# Altium project Hardware.PrjPcb
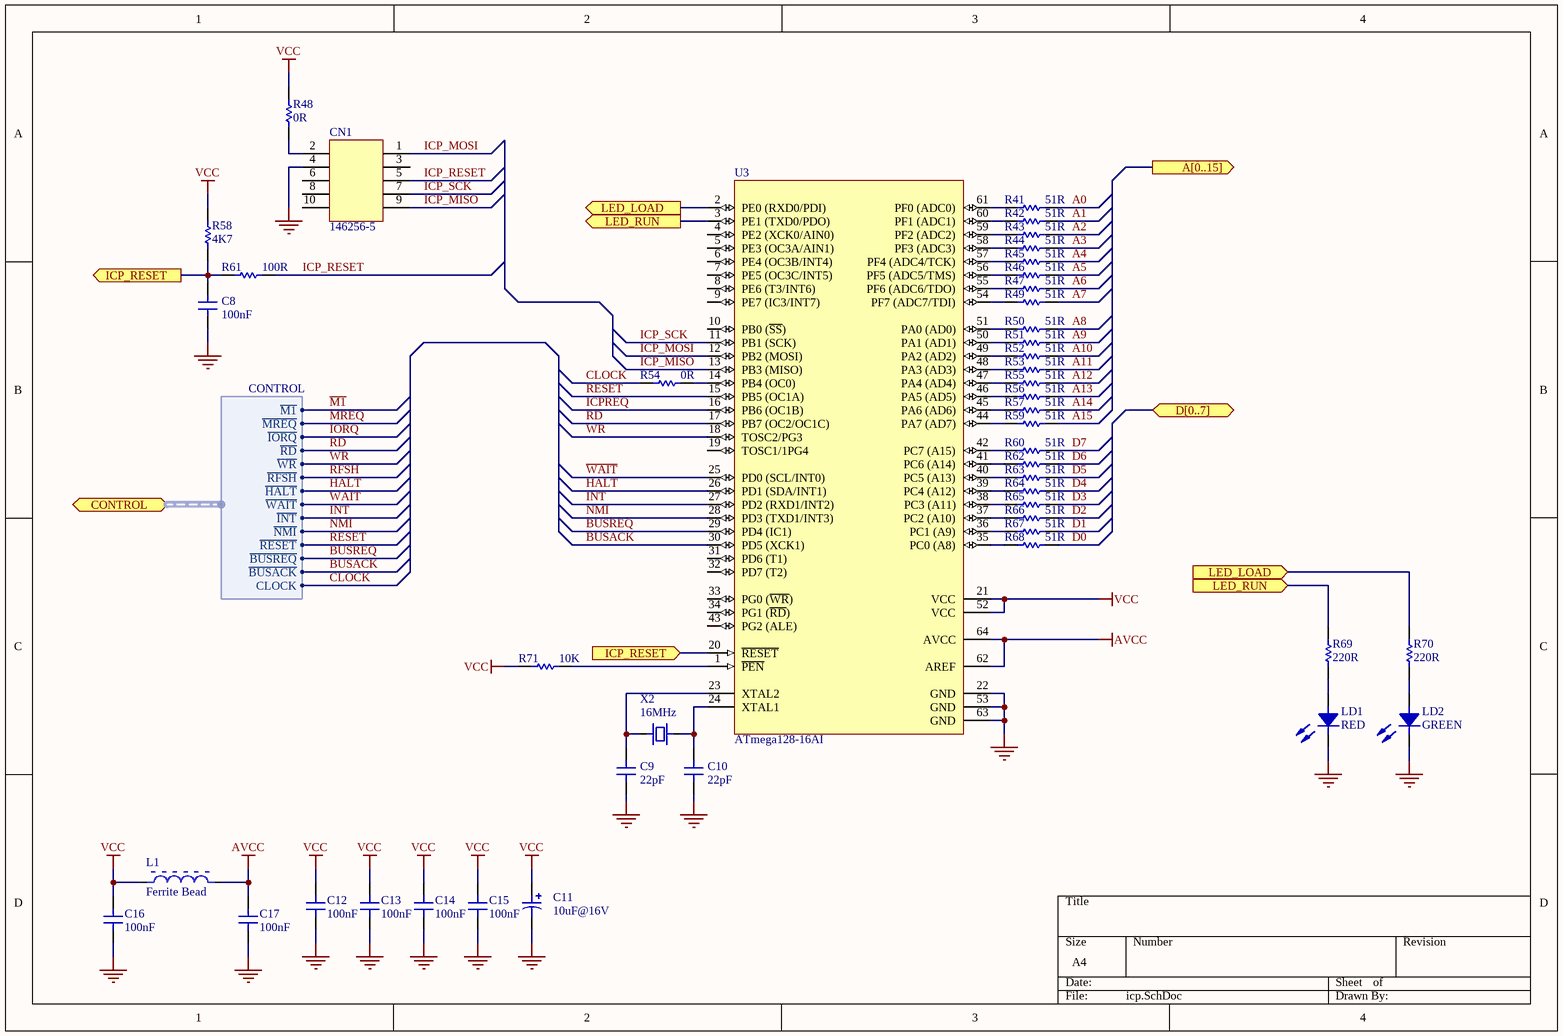
[diagram p0: icp.SchDoc]
6 sheets, 81 parts. Net scope: hierarchical (ports join the sheet entries above them; power ports are global).
Board file: Zillion.PcbDoc
Sheets:
  parallel.SchDoc
  icp.SchDoc
  Zillion.SchDoc
    CPU = cpu.SchDoc
    Memory = memory.SchDoc
    UART = uart.SchDoc

## Sheet parallel.SchDoc
size A4

## Sheet icp.SchDoc
size A4

### Parts
(Parts that share a designator on the sheet are numbered #1, #2 ... from top to bottom, then left to right.)
C8#1  100nF  [0805]
C9#1  22pF  [0805]
C10#1  22pF  [0805]
C11#1  10uF@16V  [1206 Polarized]
C12  100nF  [0805]
C13  100nF  [0805]
C14  100nF  [0805]
C15  100nF  [0805]
C16  100nF  [0805]
C17  100nF  [0805]
CN1#1  146256-5  [146256-5]
L1  Ferrite Bead  [0805]
LD1  RED  [0805 Semiconductor]
LD2  GREEN  [0805 Semiconductor]
R41  51R  [0805]
R42  51R  [0805]
R43  51R  [0805]
R44  51R  [0805]
R45  51R  [0805]
R46  51R  [0805]
R47  51R  [0805]
R48  0R  [0402]
R49  51R  [0805]
R50  51R  [0805]
R51  51R  [0805]
R52  51R  [0805]
R53  51R  [0805]
R54  0R  [0402]
R55  51R  [0805]
R56  51R  [0805]
R57  51R  [0805]
R58  4K7  [0805]
R59  51R  [0805]
R60  51R  [0805]
R61  100R  [0805]
R62  51R  [0805]
R63  51R  [0805]
R64  51R  [0805]
R65  51R  [0805]
R66  51R  [0805]
R67  51R  [0805]
R68  51R  [0805]
R69  220R  [0805]
R70  220R  [0805]
R71  10K  [0402]
U3#1  ATmega128-16AI  [64A_N]
X2  16MHz  [HC49S]

### Ports
A[0..15] (out), CONTROL (harness CONTROL), D[0..7] (bidir), ICP_RESET (in), ICP_RESET (out), LED_LOAD (in), LED_LOAD (out), LED_RUN (in), LED_RUN (out)

### Harnesses
CONTROL: ~{M1}, ~{MREQ}, ~{IORQ}, ~{RD}, ~{WR}, ~{RFSH}, ~{HALT}, ~{WAIT}, ~{INT}, ~{NMI}, ~{RESET}, ~{BUSREQ}, ~{BUSACK}, CLOCK

### Nets
AVCC: C17.1 L1.2 U3#1.62(AREF) U3#1.64(AVCC)
GND: C8#1.1 C9#1.1 C10#1.1 C11#1.2 C12.2 C13.2 C14.2 C15.2 C16.2 C17.2 CN1#1.4 LD1.1 LD2.1 U3#1.22(GND) U3#1.53(GND) U3#1.63(GND)
VCC: C11#1.1 C12.1 C13.1 C14.1 C15.1 C16.1 L1.1 R48.2 R58.2 R71.2 U3#1.21(VCC) U3#1.52(VCC)
A0: R41.2
A1: R42.2
A2: R43.2
A3: R44.2
A4: R45.2
A5: R46.2
A6: R47.2
A7: R49.2
A8: R50.2
A9: R51.2
A10: R52.2
A11: R53.2
A12: R55.2
A13: R56.2
A14: R57.2
A15: R59.2
~{BUSACK}: U3#1.30(PD5_(XCK1)) ; port CONTROL.~{BUSACK}
~{BUSREQ}: U3#1.29(PD4_(IC1)) ; port CONTROL.~{BUSREQ}
CLOCK: R54.2 ; port CONTROL.CLOCK
D0: R68.2
D1: R67.2
D2: R66.2
D3: R65.2
D4: R64.2
D5: R63.2
D6: R62.2
D7: R60.2
~{HALT}: U3#1.26(PD1_(SDA/INT1)) ; port CONTROL.~{HALT}
~{ICPREQ}: U3#1.16(PB6_(OC1B))
~{INT}: U3#1.27(PD2_(RXD1/INT2)) ; port CONTROL.~{INT}
~{IORQ}: port CONTROL.~{IORQ}
ICP_MISO: CN1#1.9 U3#1.13(PB3_(MISO))
ICP_MOSI: CN1#1.1 U3#1.12(PB2_(MOSI))
ICP_RESET: CN1#1.5 R61.1
ICP_SCK: CN1#1.7 U3#1.11(PB1_(SCK))
~{M1}: port CONTROL.~{M1}
~{MREQ}: port CONTROL.~{MREQ}
~{NMI}: U3#1.28(PD3_(TXD1/INT3)) ; port CONTROL.~{NMI}
~{RD}: U3#1.17(PB7_(OC2/OC1C)) ; port CONTROL.~{RD}
~{RESET}: U3#1.15(PB5_(OC1A)) ; port CONTROL.~{RESET}
~{RFSH}: port CONTROL.~{RFSH}
~{WAIT}: U3#1.25(PD0_(SCL/INT0)) ; port CONTROL.~{WAIT}
~{WR}: U3#1.18(TOSC2/PG3) ; port CONTROL.~{WR}
NetC8#1_2: C8#1.2 R58.1 R61.2 U3#1.20(~{RESET}) ; port ICP_RESET
NetC9#1_2: C9#1.2 U3#1.23(XTAL2) X2.1
NetC10#1_2: C10#1.2 U3#1.24(XTAL1) X2.2
NetCN1#1_2: CN1#1.2 R48.1
NetLD1_2: LD1.2 R69.1
NetLD2_2: LD2.2 R70.1
NetR41_1: R41.1 U3#1.61(PF0_(ADC0))
NetR42_1: R42.1 U3#1.60(PF1_(ADC1))
NetR43_1: R43.1 U3#1.59(PF2_(ADC2))
NetR44_1: R44.1 U3#1.58(PF3_(ADC3))
NetR45_1: R45.1 U3#1.57(PF4_(ADC4/TCK))
NetR46_1: R46.1 U3#1.56(PF5_(ADC5/TMS))
NetR47_1: R47.1 U3#1.55(PF6_(ADC6/TDO))
NetR49_1: R49.1 U3#1.54(PF7_(ADC7/TDI))
NetR50_1: R50.1 U3#1.51(PA0_(AD0))
NetR51_1: R51.1 U3#1.50(PA1_(AD1))
NetR52_1: R52.1 U3#1.49(PA2_(AD2))
NetR53_1: R53.1 U3#1.48(PA3_(AD3))
NetR54_1: R54.1 U3#1.14(PB4_(OC0))
NetR55_1: R55.1 U3#1.47(PA4_(AD4))
NetR56_1: R56.1 U3#1.46(PA5_(AD5))
NetR57_1: R57.1 U3#1.45(PA6_(AD6))
NetR59_1: R59.1 U3#1.44(PA7_(AD7))
NetR60_1: R60.1 U3#1.42(PC7_(A15))
NetR62_1: R62.1 U3#1.41(PC6_(A14))
NetR63_1: R63.1 U3#1.40(PC5_(A13))
NetR64_1: R64.1 U3#1.39(PC4_(A12))
NetR65_1: R65.1 U3#1.38(PC3_(A11))
NetR66_1: R66.1 U3#1.37(PC2_(A10))
NetR67_1: R67.1 U3#1.36(PC1_(A9))
NetR68_1: R68.1 U3#1.35(PC0_(A8))
NetR69_2: R69.2 U3#1.3(PE1_(TXD0/PDO)) ; port LED_RUN
NetR70_2: R70.2 U3#1.2(PE0_(RXD0/PDI)) ; port LED_LOAD
NetR71_1: R71.1 U3#1.1(~{PEN})

Not connected (* = marked no-connect by the designer): CN1#1 3 6 8 10; U3#1 4(PE2_(XCK0/AIN0)) 5(PE3_(OC3A/AIN1)) 6(PE4_(OC3B/INT4)) 7(PE5_(OC3C/INT5)) 8(PE6_(T3/INT6)) 9(PE7_(IC3/INT7)) 10(PB0_(~{SS})) 19(TOSC1/1PG4) 31(PD6_(T1)) 32(PD7_(T2)) 33(PG0_(~{WR})) 34(PG1_(~{RD})) 43(PG2_(ALE))

### Library data of the parts
C8#1 C9#1 C10#1 C12-C17 = Capacitor
C11#1 = Capacitor Polarized
CN1#1 = 146256-5: CONN Header Breakaway
LD1 LD2 = LED
R41-R71 = Resistor
U3#1 = ATmega128-16AI: 8-Bit AVR Microcontroller with 128K Bytes of In-System Programmable Flash Memory; Published: 17-Sep-2003; LatestRevisionDate: 16-Oct-2006; LatestRevisionNote: IPC-7351 Footprint Added.; DatasheetVersion: 2467G-AVR-09/02; PackageVersion: revB, Oct-2001; PackageReference: 64A; Publisher: Altium Limited; PackageDescription: 64-Pin Plastic Thin Profile Quad Flat Pack, 14 x 14 x 1.0 mm Body, 0.8 mm Pitch (TQFP); Supplier 1: Digi-Key; Supplier Part Number 1: ATMEGA128-16AI-ND; Supplier 2: Mouser; Supplier Part Number 2: 556-ATMEGA12816AI; Code_JEDEC: MS-026-AEB; ComponentLink1Description: Datasheet; ComponentLink1URL: http://www.atmel.com/dyn/resources/prod_documents/doc2467.pdf; ComponentLink2Description: Atmel.com Home; ComponentLink2URL: http://www.atmel.com
X2 = HC49S: Crystal HC49S

## Sheet Zillion.SchDoc: Zillion - Z80 Single Board Computer
size A4; Author: Francesco Sacco; Revision: 0; ProjectName: Zillion - Z80 Single Board Computer
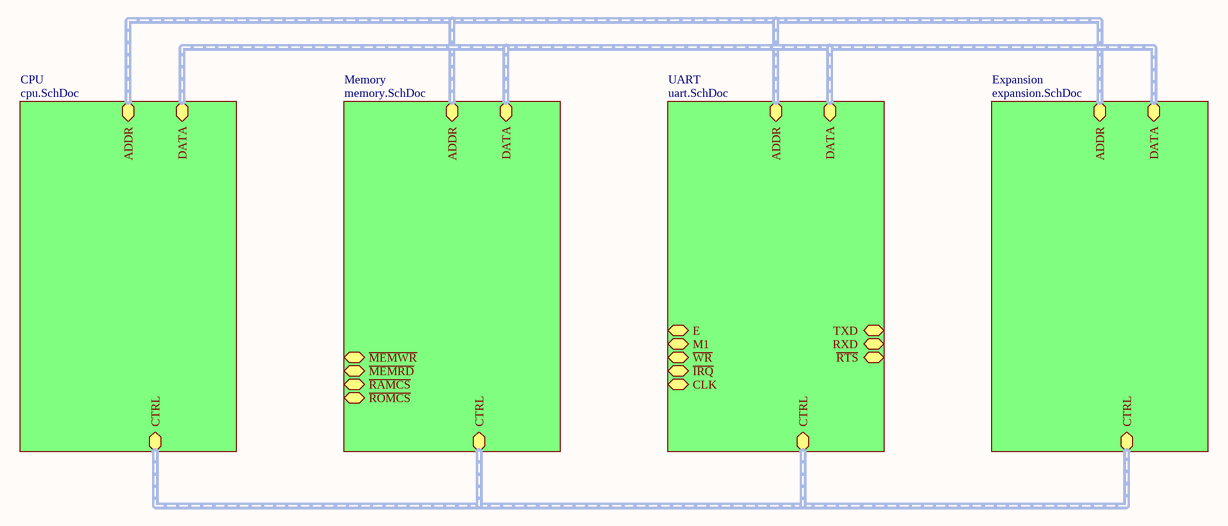
[diagram p1: Zillion.SchDoc]

### Sub-sheets
CPU = cpu.SchDoc: ADDR (harness ADDR), DATA (harness DATA), CTRL (harness CTRL)
Expansion = expansion.SchDoc (file not in this document): ADDR (harness ADDR), DATA (harness DATA), CTRL (harness CTRL)
Memory = memory.SchDoc: ADDR (harness ADDR), DATA (harness DATA), CTRL (harness CTRL), ~{MEMWR}, ~{MEMRD}, ~{RAMCS}, ~{ROMCS}
UART = uart.SchDoc: ADDR (harness ADDR), DATA (harness DATA), CTRL (harness CTRL), E, M1, ~{WR}, ~{IRQ}, CLK, ~{RTS}, TXD, RXD

### Buses and harness runs
harness sheet CPU/ADDR = sheet Expansion/ADDR = sheet Memory/ADDR = sheet UART/ADDR
harness sheet CPU/CTRL = sheet Expansion/CTRL = sheet Memory/CTRL = sheet UART/CTRL
harness sheet CPU/DATA = sheet Expansion/DATA = sheet Memory/DATA = sheet UART/DATA

## Sheet cpu.SchDoc: Zillion - Z80 Single Board Computer
size A4; Author: Francesco Sacco; Revision: 0; ProjectName: Zillion - Z80 Single Board Computer
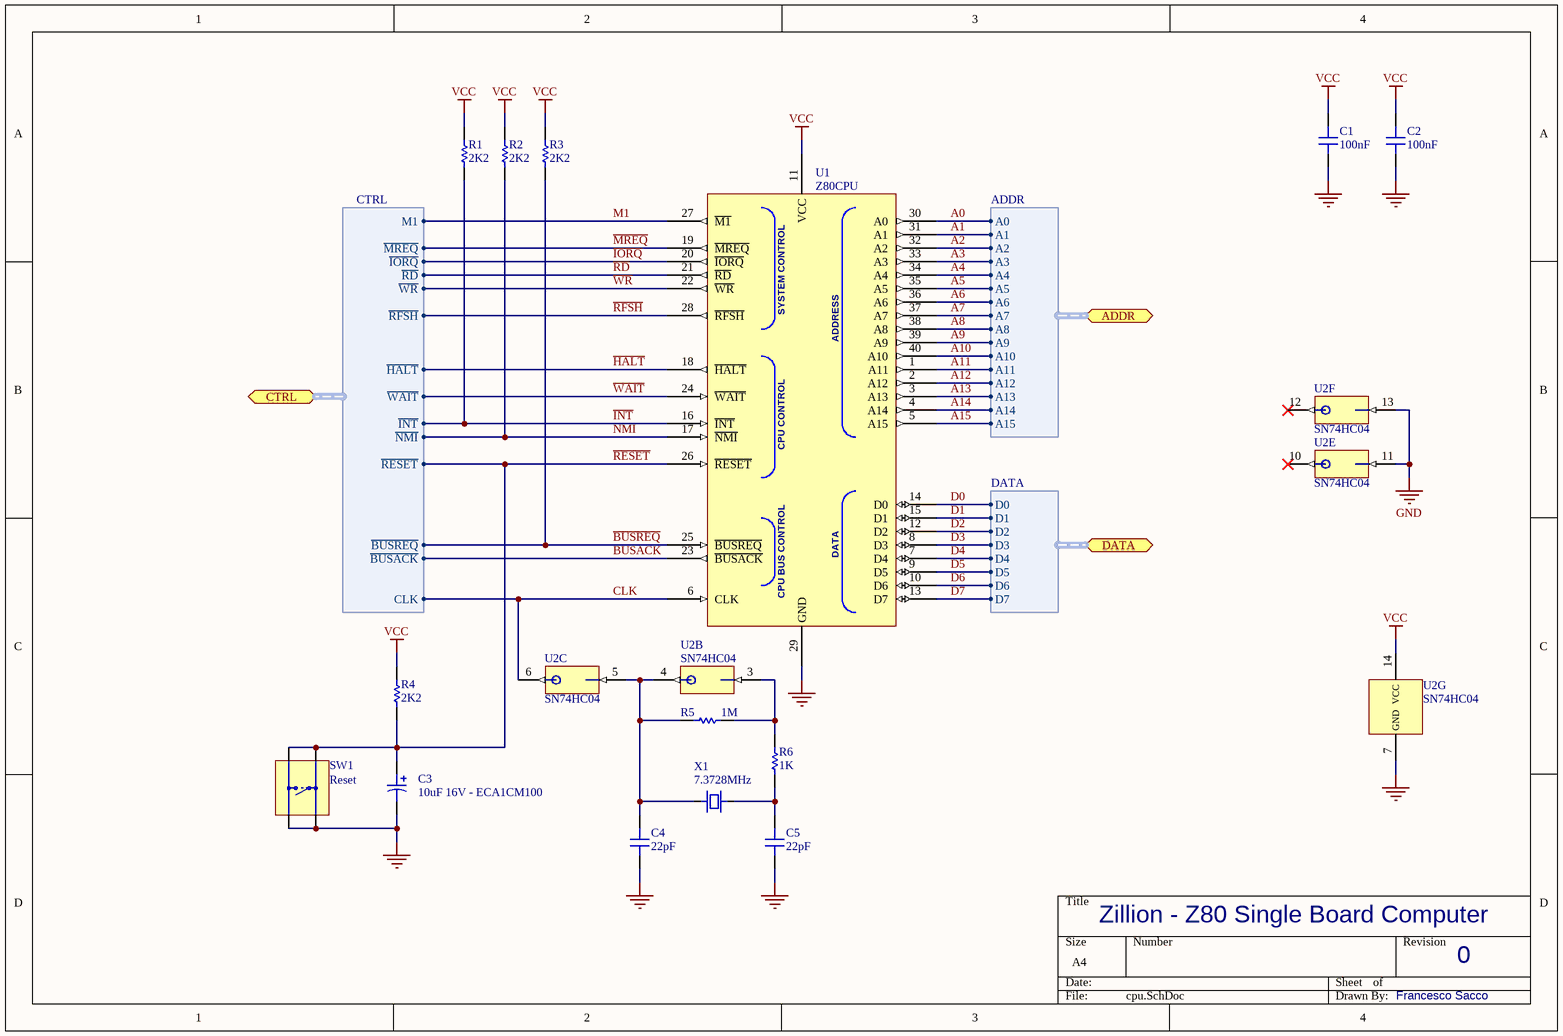
[diagram p2: cpu.SchDoc]

### Parts
C1  100nF  [DiskCapacitor]
C2  100nF  [DiskCapacitor]
C3  10uF 16V - ECA1CM100  [ECA 5x11]
C4  22pF  [DiskCapacitor]
C5  22pF  [DiskCapacitor]
R1  2K2  [CR12]
R2  2K2  [CR12]
R3  2K2  [CR12]
R4  2K2  [CR12]
R5  1M  [CR12]
R6  1K  [CR12]
SW1  Reset  [EVQPAx09K]
U1  Z80CPU  [Z84C00xxPEG]
U2  SN74HC04  [CDIP14]  (parts B,C,E,F,G of 7)
X1  7.3728MHz  [HC49S]

### Ports
ADDR (harness ADDR), CTRL (harness CTRL), DATA (harness DATA)

### Harnesses
ADDR: A0, A1, A2, A3, A4, A5, A6, A7, A8, A9, A10, A11, A12, A13, A14, A15
DATA: D0, D1, D2, D3, D4, D5, D6, D7
CTRL: M1, ~{MREQ}, ~{IORQ}, ~{RD}, ~{WR}, ~{RFSH}, ~{HALT}, ~{WAIT}, ~{INT}, ~{NMI}, ~{RESET}, ~{BUSREQ}, ~{BUSACK}, CLK

### Nets
GND: C1.1 C2.1 C3.2 C4.1 C5.1 SW1.1 SW1.2 U1.29(GND) U2.7(GND) U2.11(A) U2.13(A)
VCC: C1.2 C2.2 R1.2 R2.2 R3.2 R4.2 U1.11(VCC) U2.14(VCC)
A0: U1.30(A0) ; port ADDR.A0
A1: U1.31(A1) ; port ADDR.A1
A2: U1.32(A2) ; port ADDR.A2
A3: U1.33(A3) ; port ADDR.A3
A4: U1.34(A4) ; port ADDR.A4
A5: U1.35(A5) ; port ADDR.A5
A6: U1.36(A6) ; port ADDR.A6
A7: U1.37(A7) ; port ADDR.A7
A8: U1.38(A8) ; port ADDR.A8
A9: U1.39(A9) ; port ADDR.A9
A10: U1.40(A10) ; port ADDR.A10
A11: U1.1(A11) ; port ADDR.A11
A12: U1.2(A12) ; port ADDR.A12
A13: U1.3(A13) ; port ADDR.A13
A14: U1.4(A14) ; port ADDR.A14
A15: U1.5(A15) ; port ADDR.A15
~{BUSACK}: U1.23(~{BUSACK}) ; port CTRL.~{BUSACK}
~{BUSREQ}: R3.1 U1.25(~{BUSREQ}) ; port CTRL.~{BUSREQ}
CLK: U1.6(CLK) U2.6(Y) ; port CTRL.CLK
D0: U1.14(D0) ; port DATA.D0
D1: U1.15(D1) ; port DATA.D1
D2: U1.12(D2) ; port DATA.D2
D3: U1.8(D3) ; port DATA.D3
D4: U1.7(D4) ; port DATA.D4
D5: U1.9(D5) ; port DATA.D5
D6: U1.10(D6) ; port DATA.D6
D7: U1.13(D7) ; port DATA.D7
~{HALT}: U1.18(~{HALT}) ; port CTRL.~{HALT}
~{INT}: R1.1 U1.16(~{INT}) ; port CTRL.~{INT}
~{IORQ}: U1.20(~{IORQ}) ; port CTRL.~{IORQ}
M1: U1.27(~{M1}) ; port CTRL.M1
~{MREQ}: U1.19(~{MREQ}) ; port CTRL.~{MREQ}
~{NMI}: R2.1 U1.17(~{NMI}) ; port CTRL.~{NMI}
~{RD}: U1.21(~{RD}) ; port CTRL.~{RD}
~{RESET}: C3.1 R4.1 SW1.3 SW1.4 U1.26(~{RESET}) ; port CTRL.~{RESET}
~{RFSH}: U1.28(~{RFSH}) ; port CTRL.~{RFSH}
~{WAIT}: U1.24(~{WAIT}) ; port CTRL.~{WAIT}
~{WR}: U1.22(~{WR}) ; port CTRL.~{WR}
NetC4_2: C4.2 R5.2 U2.4(Y) U2.5(A) X1.1
NetC5_2: C5.2 R6.1 X1.2
NetR5_1: R5.1 R6.2 U2.3(A)

Not connected (* = marked no-connect by the designer): U2 10(Y)* 12(Y)*

### Notes on the sheet
- (in symbol Z84C00xxPEG) SYSTEM CONTROL; ADDRESS; CPU CONTROL; DATA; CPU BUS CONTROL

### Library data of the parts
C1 C2 C4 C5 = Capacitor
C3 = ECA1CM100: 10uF 16V
R1-R4 = Resistor
R5 R6 = Resistor: 2K2
SW1 = EVQPA: 5N Type Light Touch Switches
U1 = Z84C00xxPEG: Z80 - CPU
U2 = SN74HC04: Hex Inverters
X1 = HC49S: Crystal HC49S

## Sheet memory.SchDoc: Zillion - Z80 Single Board Computer
size A4; Author: Francesco Sacco; Revision: 0; ProjectName: Zillion - Z80 Single Board Computer
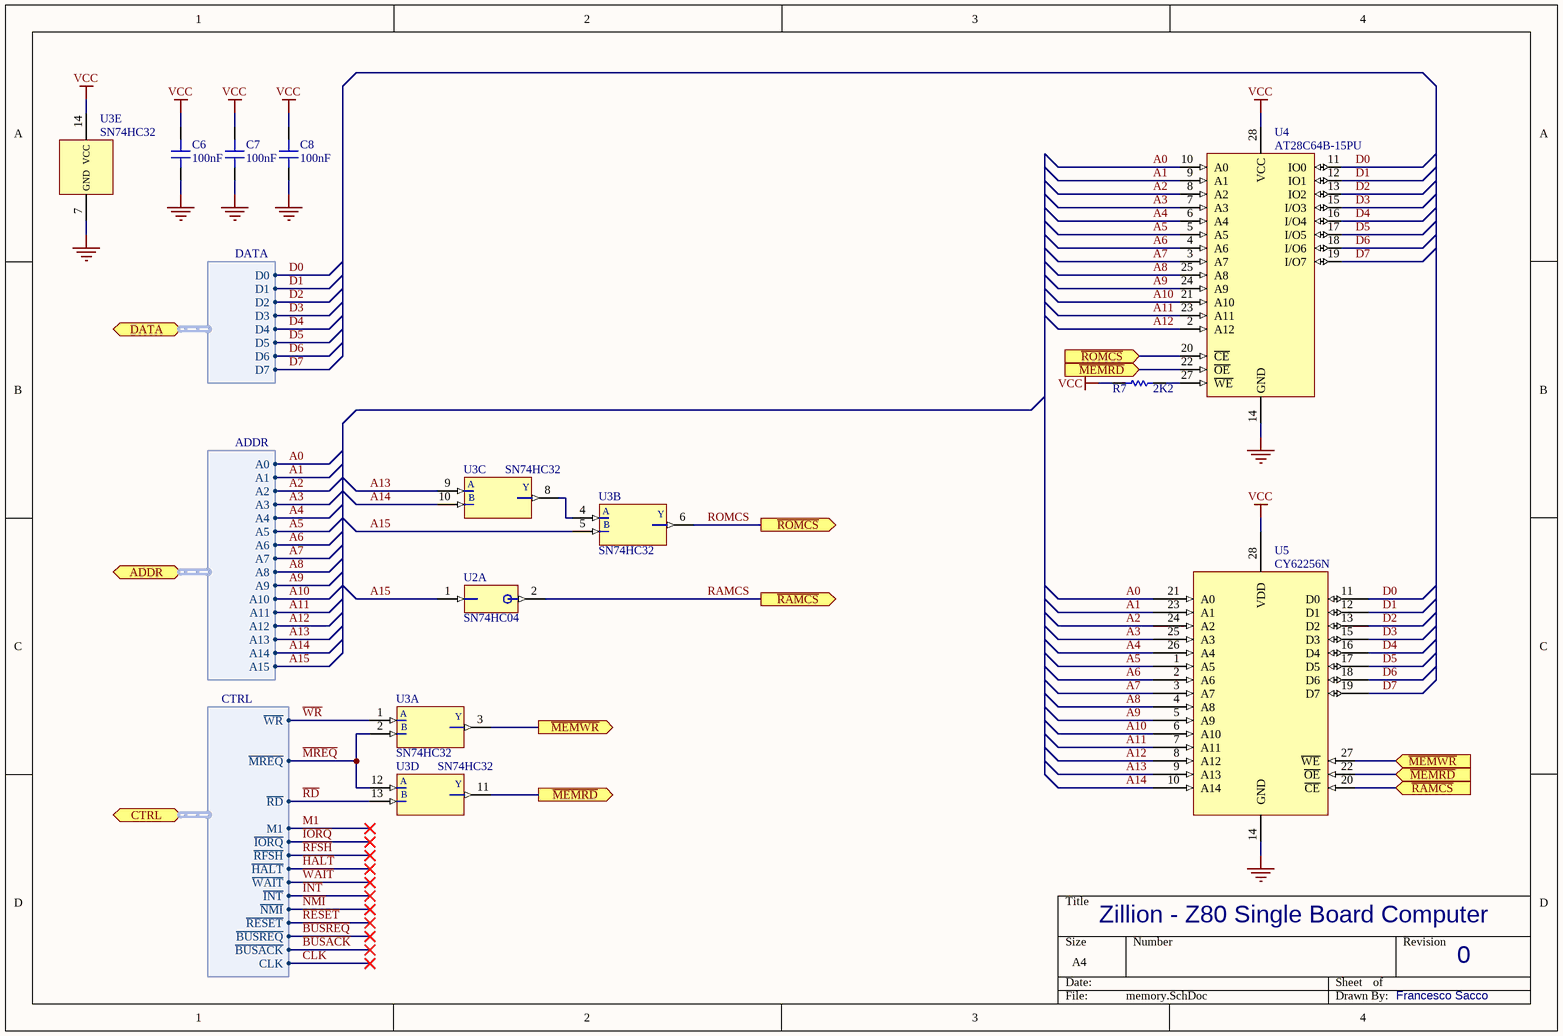
[diagram p3: memory.SchDoc]

### Parts
(Parts that share a designator on the sheet are numbered #1, #2 ... from top to bottom, then left to right.)
C6  100nF  [DiskCapacitor]
C7  100nF  [DiskCapacitor]
C8#2  100nF  [DiskCapacitor]
R7  2K2  [CR12]
U2  SN74HC04  [CDIP14]  (part A of 7)
U3#2  SN74HC32  [CDIP14]  (parts A,B,C,D,E of 5)
U4  AT28C64B-15PU  [PDIP28]
U5  CY62256N  [PDIP28]

### Ports
ADDR (harness ADDR), CTRL (harness CTRL), DATA (harness DATA), ~{MEMRD} (in), ~{MEMRD} (out), ~{MEMWR} (in), ~{MEMWR} (out), ~{RAMCS} (in), ~{RAMCS} (out), ~{ROMCS} (in), ~{ROMCS} (out)

### Harnesses
ADDR: A0, A1, A2, A3, A4, A5, A6, A7, A8, A9, A10, A11, A12, A13, A14, A15
DATA: D0, D1, D2, D3, D4, D5, D6, D7
CTRL: M1, ~{MREQ}, ~{IORQ}, ~{RD}, ~{WR}, ~{RFSH}, ~{HALT}, ~{WAIT}, ~{INT}, ~{NMI}, ~{RESET}, ~{BUSREQ}, ~{BUSACK}, CLK

### Nets
GND: C6.1 C7.1 C8#2.1 U3#2.7(GND) U4.14(GND) U5.14(GND)
VCC: C6.2 C7.2 C8#2.2 R7.2 U3#2.14(VCC) U4.28(VCC) U5.28(VDD)
A0: U4.10(A0) U5.21(A0) ; port ADDR.A0
A1: U4.9(A1) U5.23(A1) ; port ADDR.A1
A2: U4.8(A2) U5.24(A2) ; port ADDR.A2
A3: U4.7(A3) U5.25(A3) ; port ADDR.A3
A4: U4.6(A4) U5.26(A4) ; port ADDR.A4
A5: U4.5(A5) U5.1(A5) ; port ADDR.A5
A6: U4.4(A6) U5.2(A6) ; port ADDR.A6
A7: U4.3(A7) U5.3(A7) ; port ADDR.A7
A8: U4.25(A8) U5.4(A8) ; port ADDR.A8
A9: U4.24(A9) U5.5(A9) ; port ADDR.A9
A10: U4.21(A10) U5.6(A10) ; port ADDR.A10
A11: U4.23(A11) U5.7(A11) ; port ADDR.A11
A12: U4.2(A12) U5.8(A12) ; port ADDR.A12
A13: U3#2.9(A) U5.9(A13) ; port ADDR.A13
A14: U3#2.10(B) U5.10(A14) ; port ADDR.A14
A15: U2.1(A) U3#2.5(B) ; port ADDR.A15
D0: U4.11(IO0) U5.11(D0) ; port DATA.D0
D1: U4.12(IO1) U5.12(D1) ; port DATA.D1
D2: U4.13(IO2) U5.13(D2) ; port DATA.D2
D3: U4.15(I/O3) U5.15(D3) ; port DATA.D3
D4: U4.16(I/O4) U5.16(D4) ; port DATA.D4
D5: U4.17(I/O5) U5.17(D5) ; port DATA.D5
D6: U4.18(I/O6) U5.18(D6) ; port DATA.D6
D7: U4.19(I/O7) U5.19(D7) ; port DATA.D7
~{MREQ}: U3#2.2(B) U3#2.12(A) ; port CTRL.~{MREQ}
~{RD}: U3#2.13(B) ; port CTRL.~{RD}
RAMCS: U2.2(Y) U5.20(~{CE}) ; port ~{RAMCS}
ROMCS: U3#2.6(Y) U4.20(~{CE}) ; port ~{ROMCS}
~{WR}: U3#2.1(A) ; port CTRL.~{WR}
NetR7_1: R7.1 U4.27(~{WE})
NetU3#2_3: U3#2.3(Y) U5.27(~{WE}) ; port ~{MEMWR}
NetU3#2_4: U3#2.4(A) U3#2.8(Y)
NetU3#2_11: U3#2.11(Y) U4.22(~{OE}) U5.22(~{OE}) ; port ~{MEMRD}

### Library data of the parts
C6 C7 C8#2 = Capacitor
R7 = Resistor
U2 = SN74HC04: Hex Inverters
U3#2 = SN74HC32: Quadruple 2-Input Positive-OR Gates
U4 = AT28C64B-15PU: 64K (8K x 8) Parallel EEPROM
U5 = CY62256N: 256-Kbit (32 K × 8) Static RAM

## Sheet uart.SchDoc: Zillion - Z80 Single Board Computer
size A4; Author: Francesco Sacco; Revision: 0; ProjectName: Zillion - Z80 Single Board Computer
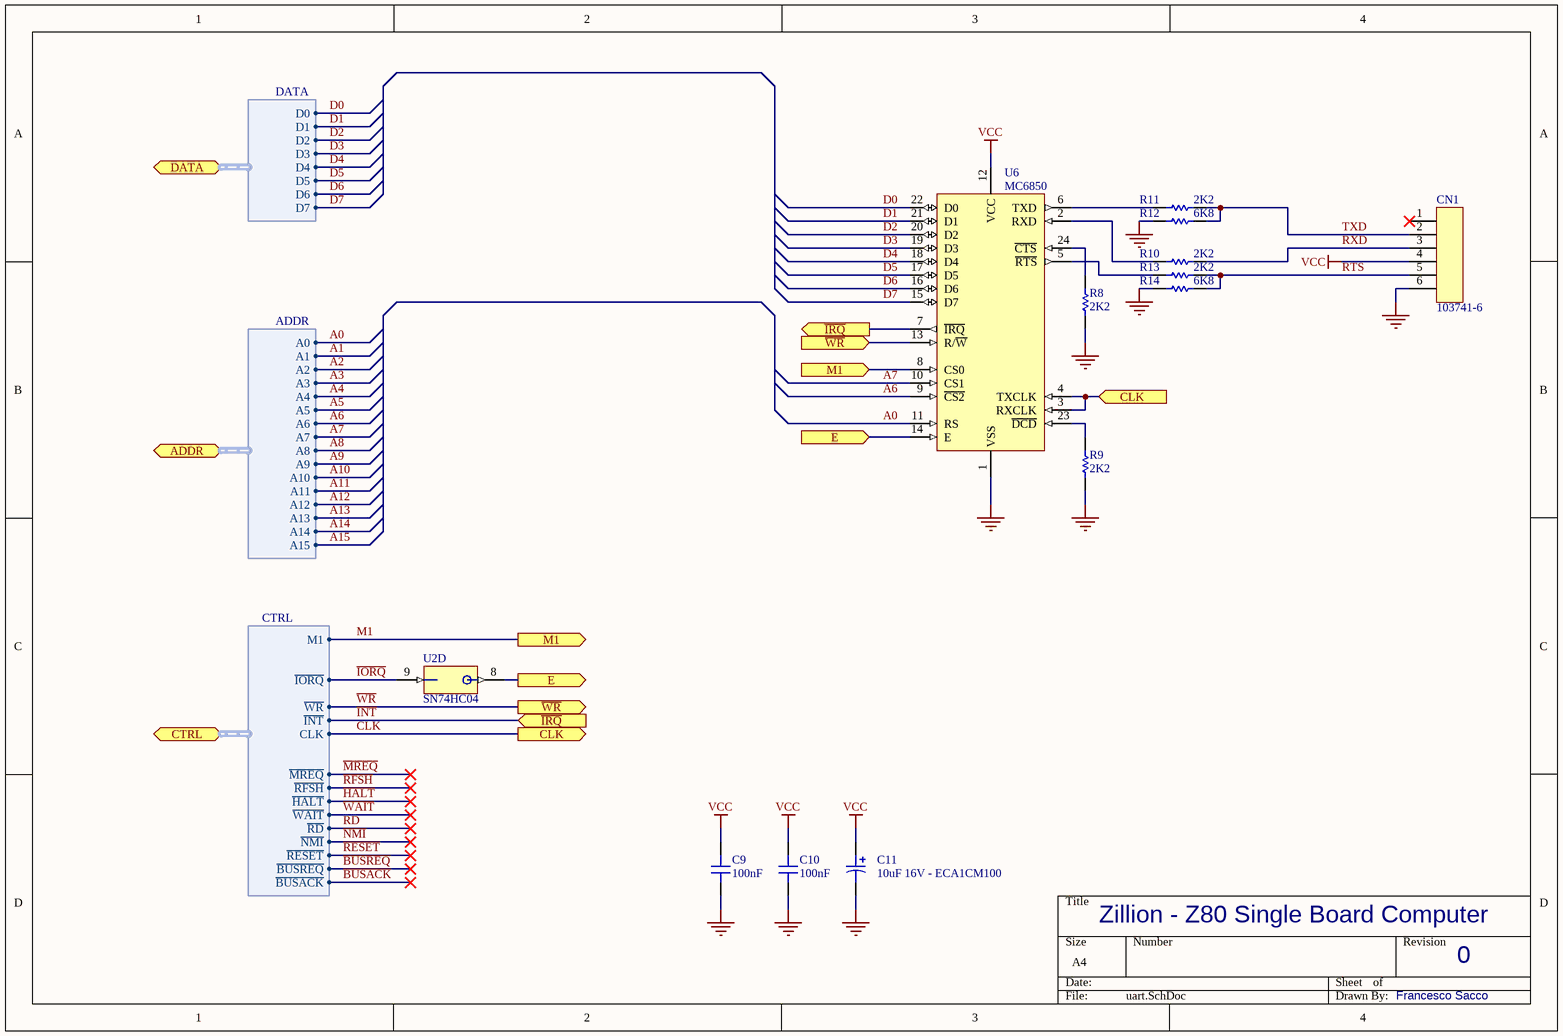
[diagram p4: uart.SchDoc]

### Parts
(Parts that share a designator on the sheet are numbered #1, #2 ... from top to bottom, then left to right.)
C9#2  100nF  [DiskCapacitor]
C10#2  100nF  [DiskCapacitor]
C11#2  10uF 16V - ECA1CM100  [ECA 5x11]
CN1#2  103741-6  [103741-6]
R8  2K2  [CR12]
R9  2K2  [CR12]
R10  2K2  [CR12]
R11  2K2  [CR12]
R12  6K8  [CR12]
R13  2K2  [CR12]
R14  6K8  [CR12]
U2  SN74HC04  [TSSOP14]  (part D of 7)
U6  MC6850  [PDIP24]

### Ports
ADDR (harness ADDR), CLK (in), CLK (out), CTRL (harness CTRL), DATA (harness DATA), E (in), E (out), M1 (in), M1 (out), ~{IRQ} (in), ~{IRQ} (out), ~{WR} (in), ~{WR} (out)

### Harnesses
ADDR: A0, A1, A2, A3, A4, A5, A6, A7, A8, A9, A10, A11, A12, A13, A14, A15
DATA: D0, D1, D2, D3, D4, D5, D6, D7
CTRL: M1, ~{MREQ}, ~{IORQ}, ~{RD}, ~{WR}, ~{RFSH}, ~{HALT}, ~{WAIT}, ~{INT}, ~{NMI}, ~{RESET}, ~{BUSREQ}, ~{BUSACK}, CLK

### Nets
GND: C9#2.1 C10#2.1 C11#2.2 CN1#2.6 R8.1 R9.1 R12.1 R14.1 U6.1(VSS)
VCC: C9#2.2 C10#2.2 C11#2.1 CN1#2.4 U6.12(VCC)
A0: U6.11(RS) ; port ADDR.A0
A6: U6.9(~{CS2}) ; port ADDR.A6
A7: U6.10(CS1) ; port ADDR.A7
CLK: U6.3(RXCLK) U6.4(TXCLK) ; port CLK, port CTRL.CLK
D0: U6.22(D0) ; port DATA.D0
D1: U6.21(D1) ; port DATA.D1
D2: U6.20(D2) ; port DATA.D2
D3: U6.19(D3) ; port DATA.D3
D4: U6.18(D4) ; port DATA.D4
D5: U6.17(D5) ; port DATA.D5
D6: U6.16(D6) ; port DATA.D6
D7: U6.15(D7) ; port DATA.D7
~{INT}: U6.7(~{IRQ}) ; port ~{IRQ}, port CTRL.~{INT}
~{IORQ}: U2.9(A) ; port CTRL.~{IORQ}
M1: U6.8(CS0) ; port M1, port CTRL.M1
RTS: CN1#2.5 R13.1 R14.2
RXD: CN1#2.3 R10.1
TXD: CN1#2.2 R11.1 R12.2
~{WR}: U6.13(R/~{W}) ; port ~{WR}, port CTRL.~{WR}
NetR8_2: R8.2 U6.24(~{CTS})
NetR9_2: R9.2 U6.23(~{DCD})
NetR10_2: R10.2 U6.2(RXD)
NetR11_2: R11.2 U6.6(TXD)
NetR13_2: R13.2 U6.5(~{RTS})
NetU2_8: U2.8(Y) U6.14(E) ; port E

Not connected (* = marked no-connect by the designer): CN1#2 1*

### Library data of the parts
C9#2 C10#2 = Capacitor
C11#2 = ECA1CM100: 10uF 16V
CN1#2 = 103741-6: CONN Breakaway Single Row
R8-R14 = Resistor
U2 = SN74HC04: Hex Inverters
U6 = MC6850: Asynchronous Communications Interface Adapter (ACIA)

## Nets that join several sheets
GND: icp (16 pins), cpu (11 pins), memory (6 pins), uart (9 pins)
VCC: icp (12 pins), cpu (8 pins), memory (7 pins), uart (5 pins)
A0: cpu (U1.30), memory (U4.10 U5.21), uart (U6.11)
A1: cpu (U1.31), memory (U4.9 U5.23)
A2: cpu (U1.32), memory (U4.8 U5.24)
A3: cpu (U1.33), memory (U4.7 U5.25)
A4: cpu (U1.34), memory (U4.6 U5.26)
A5: cpu (U1.35), memory (U4.5 U5.1)
A6: cpu (U1.36), memory (U4.4 U5.2), uart (U6.9)
A7: cpu (U1.37), memory (U4.3 U5.3), uart (U6.10)
A8: cpu (U1.38), memory (U4.25 U5.4)
A9: cpu (U1.39), memory (U4.24 U5.5)
A10: cpu (U1.40), memory (U4.21 U5.6)
A11: cpu (U1.1), memory (U4.23 U5.7)
A12: cpu (U1.2), memory (U4.2 U5.8)
A13: cpu (U1.3), memory (U3#2.9 U5.9)
A14: cpu (U1.4), memory (U3#2.10 U5.10)
A15: cpu (U1.5), memory (U2.1 U3#2.5)
CLK: cpu (U1.6 U2.6), uart (U6.3 U6.4)
D0: cpu (U1.14), memory (U4.11 U5.11), uart (U6.22)
D1: cpu (U1.15), memory (U4.12 U5.12), uart (U6.21)
D2: cpu (U1.12), memory (U4.13 U5.13), uart (U6.20)
D3: cpu (U1.8), memory (U4.15 U5.15), uart (U6.19)
D4: cpu (U1.7), memory (U4.16 U5.16), uart (U6.18)
D5: cpu (U1.9), memory (U4.17 U5.17), uart (U6.17)
D6: cpu (U1.10), memory (U4.18 U5.18), uart (U6.16)
D7: cpu (U1.13), memory (U4.19 U5.19), uart (U6.15)
~{INT}: cpu (R1.1 U1.16), uart (U6.7)
~{IORQ}: cpu (U1.20), uart (U2.9)
M1: cpu (U1.27), uart (U6.8)
~{MREQ}: cpu (U1.19), memory (U3#2.2 U3#2.12)
~{RD}: cpu (U1.21), memory (U3#2.13)
~{WR}: cpu (U1.22), memory (U3#2.1), uart (U6.13)